# EAGLE design JW24A10L_revB (EAGLE 6.1)
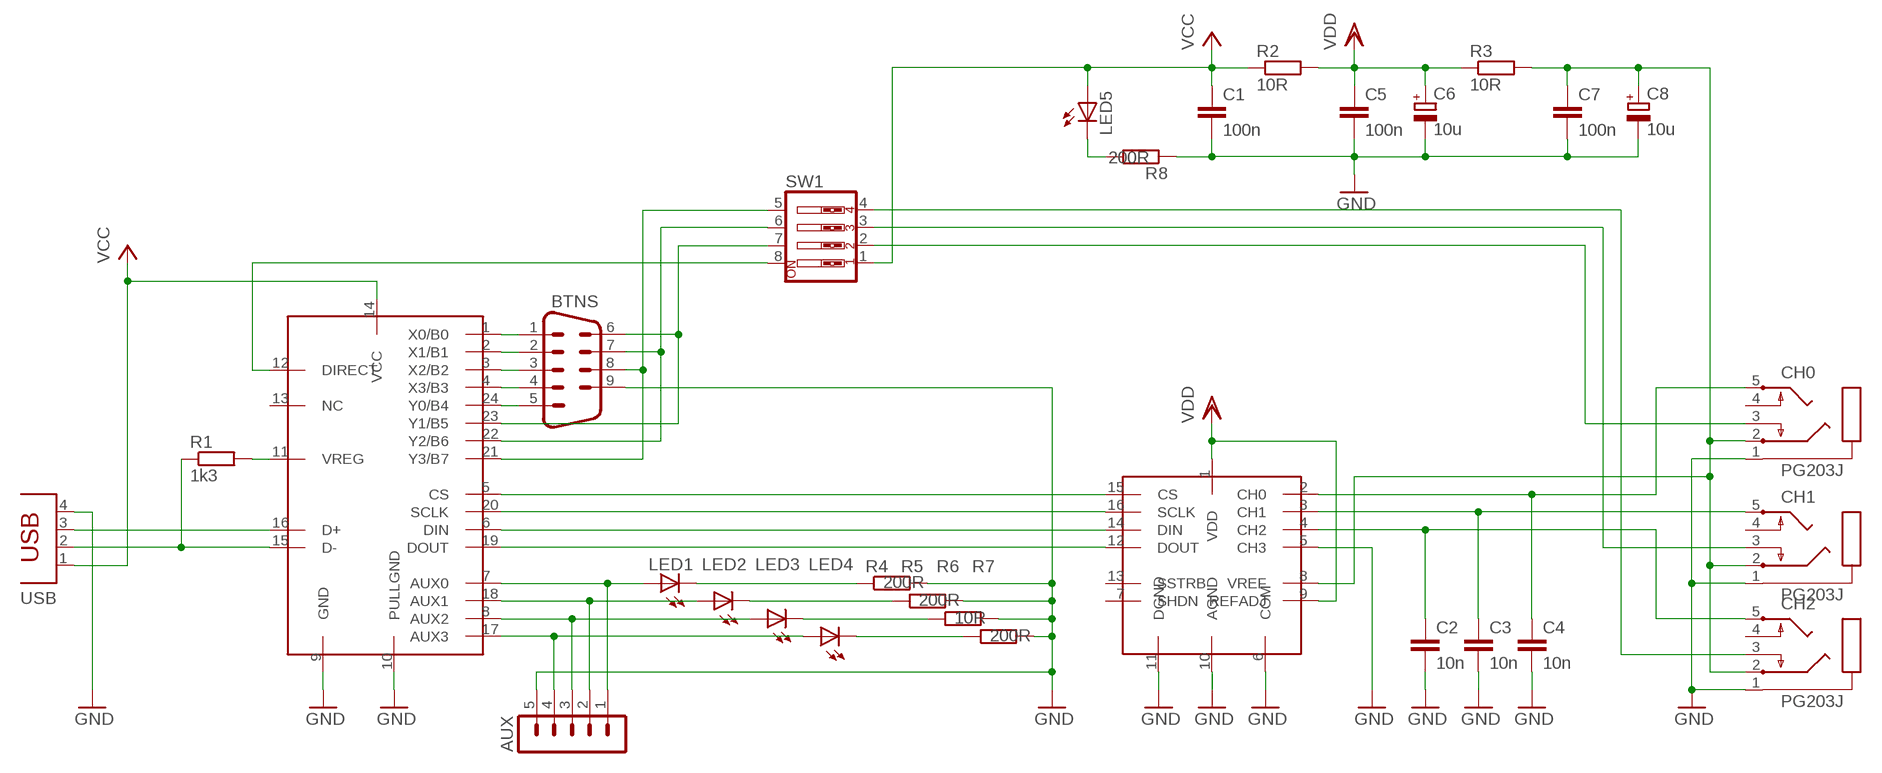
[diagram p0: schematic, sheet 1]

## Parts
AUX  MA05-1  [MA05-1]
BTNS  M09H  [M09H]
C1  100n  C-EU025-025X050  [C025-025X050]
C2  10n  C-EU025-025X050  [C025-025X050]
C3  10n  C-EU025-025X050  [C025-025X050]
C4  10n  C-EU025-025X050  [C025-025X050]
C5  100n  C-EU025-025X050  [C025-025X050]
C6  10u  CPOL-EUE2-5  [E2-5]
C7  100n  C-EU025-025X050  [C025-025X050]
C8  10u  CPOL-EUE2-5  [E2-5]
CH0  PG203J  [PG203J]
CH1  PG203J  [PG203J]
CH2  PG203J  [PG203J]
LED1  LED3MM  [LED3MM]
LED2  LED3MM  [LED3MM]
LED3  LED3MM  [LED3MM]
LED4  LED3MM  [LED3MM]
LED5  LED3MM  [LED3MM]
R1  1k3  R-EU_0204/7  [0204/7]
R2  10R  R-EU_0204/7  [0204/7]
R3  10R  R-EU_0204/7  [0204/7]
R4  200R  R-EU_0204/7  [0204/7]
R5  200R  R-EU_0204/7  [0204/7]
R6  10R  R-EU_0204/7  [0204/7]
R7  200R  R-EU_0204/7  [0204/7]
R8  200R  R-EU_0204/7  [0204/7]
SW1  SW_DIP-4  [EDG-04]
U$1  MAX1249  [DIL16]
U$2  JW24A10L  [DIL24-3]
USB  PN61729  [PN61729]

## Nets
AUX0: AUX.1 LED1.A U$2.7(AUX0)
AUX1: AUX.2 LED2.A U$2.18(AUX1)
AUX2: AUX.3 LED3.A U$2.8(AUX2)
AUX3: AUX.4 LED4.A U$2.17(AUX3)
CH1: C4.1 CH0.5 U$1.2(CH0)
CH2: CH2.3 SW1.4
GND: AUX.5 BTNS.9 C1.2 C2.2 C3.2 C4.2 C5.2 C6.- C7.2 C8.- CH0.1 CH1.1 CH2.1 R4.2 R5.2 R6.2 R7.2 R8.1 U$1.5(CH3) U$1.6(COM) U$1.10(AGND) U$1.11(DGND) U$2.9(GND) U$2.10(PULLGND) USB.4
N$1: U$1.15(CS) U$2.5(CS)
N$2: U$1.16(SCLK) U$2.20(SCLK)
N$3: U$1.14(DIN) U$2.6(DIN)
N$4: U$1.12(DOUT) U$2.19(DOUT)
N$5: U$2.16(D+) USB.3
N$6: R1.1 U$2.15(D-) USB.2
N$7: BTNS.1 U$2.1(X0/B0)
N$8: LED5.K(C) R8.2
N$9: R1.2 U$2.11(VREG)
N$10: C3.1 CH1.5 U$1.3(CH1)
N$11: C2.1 CH2.5 U$1.4(CH2)
N$12: BTNS.2 U$2.2(X1/B1)
N$13: BTNS.3 U$2.3(X2/B2)
N$14: BTNS.4 U$2.4(X3/B3)
N$15: BTNS.5 U$2.24(Y0/B4)
N$16: BTNS.6 SW1.7 U$2.23(Y1/B5)
N$17: BTNS.7 SW1.6 U$2.22(Y2/B6)
N$18: BTNS.8 SW1.5 U$2.21(Y3/B7)
N$19: SW1.8 U$2.12(DIRECT)
N$21: CH1.3 SW1.3
N$22: CH0.3 SW1.2
N$24: C7.1 C8.+ CH0.2 CH1.2 CH2.2 R3.2 U$1.8(VREF)
N$25: LED1.K(C) R4.1
N$26: LED2.K(C) R5.1
N$27: LED3.K(C) R6.1
N$28: LED4.K(C) R7.1
VCC: C1.1 LED5.A R2.1 SW1.1 U$2.14(VCC) USB.1
VDD: C5.1 C6.+ R2.2 R3.1 U$1.1(VDD) U$1.9(REFADJ)
Unconnected: CH0.4 CH1.4 CH2.4 U$1.7(SHDN) U$1.13(SSTRB) U$2.13(NC)

## Library data of the parts
AUX = con-lstb:MA05-1: PIN HEADER; OC_FARNELL: unknown; OC_NEWARK: unknown
BTNS = con-subd:M09: SUB-D; OC_FARNELL: unknown; OC_NEWARK: unknown
C1-C5 C7 = rcl:C-EU: CAPACITOR, European symbol
C6 C8 = rcl:CPOL-EU: POLARIZED CAPACITOR, European symbol
CH0 CH1 CH2 = con-hirschmann:PG203J: MIC/HEADPHONE JACK KS-S stereo microphone/headphone jack PG203JN (Schukat); OC_FARNELL: unknown; OC_NEWARK: unknown
LED1-LED5 = led:LED: LED OSRAM: - CHIPLED LG R971, LG N971, LY N971, LG Q971, LY Q971, LO R971, LY R971 LH N974, LH R974 LS Q976, LO Q976, LY Q976 LO Q996 - Hyper CHIPLED LW Q18S LB Q993, LB Q99A, LB R99A - SideLED LS A670, LO A670, LY A670, LG A670, LP A670 LB A673, LV A673, LT A673, LW A673 LH A674 LY A675 LS A676, LA A676, LO A676, LY A676, LW A676 LS A679, LY A679, LG A679 - Hyper Micro SIDELED® LS Y876, LA Y876, LO Y876, LY Y876 LT Y87S - SmartLED LW L88C, LW L88S LB L89C, LB L89S, LG L890 LS L89K, LO L89K, LY L89K LS L896, LA L896, LO L896, LY L896 - TOPLED LS T670, LO T670, LY T670, LG T670, LP T670 LSG T670, LSP T670, LSY T670, LOP T670, LYG T670 LG T671, LOG T671, LSG T671 LB T673, LV T673, LT T673, LW T673 LH T674 LS T676, LA T676, LO T676, LY T676, LB T676, LH T676, LSB T676, LW T676 LB T67C, LV T67C, LT T67C, LS T67K, LO T67K, LY T67K, LW E67C LS E67B, LA E67B, LO E67B, LY E67B, LB E67C, LV E67C, LT E67C LW T67C LS T679, LY T679, LG T679 LS T770, LO T770, LY T770, LG T770, LP T770 LB T773, LV T773, LT T773, LW T773 LH T774 LS E675, LA E675, LY E675, LS T675 LS T776, LA T776, LO T776, LY T776, LB T776 LHGB T686 LT T68C, LB T68C - Hyper Mini TOPLED® LB M676 - Mini TOPLED Santana® LG M470 LS M47K, LO M47K, LY M47K Source: http://www.osram.convergy.de LUXEON: - LUMILED® LXK2-PW12-R00, LXK2-PW12-S00, LXK2-PW14-U00, LXK2-PW14-V00 LXK2-PM12-R00, LXK2-PM12-S00, LXK2-PM14-U00 LXK2-PE12-Q00, LXK2-PE12-R00, LXK2-PE12-S00, LXK2-PE14-T00, LXK2-PE14-U00 LXK2-PB12-K00, LXK2-PB12-L00, LXK2-PB12-M00, LXK2-PB14-N00, LXK2-PB14-P00, LXK2-PB14-Q00 LXK2-PR12-L00, LXK2-PR12-M00, LXK2-PR14-Q00, LXK2-PR14-R00 LXK2-PD12-Q00, LXK2-PD12-R00, LXK2-PD12-S00 LXK2-PH12-R00, LXK2-PH12-S00 LXK2-PL12-P00, LXK2-PL12-Q00, LXK2-PL12-R00 Source: www.luxeon.com KINGBRIGHT: KA-3528ASYC Source: www.kingbright.com
R1-R8 = rcl:R-EU_: RESISTOR, European symbol
SW1 = special:SW_DIP-4: DIP SWITCH
U$1 = eigene:MAX1249
U$2 = eigene:JW24A10L
USB = con-berg:PN61729: BERG USB connector; OC_FARNELL: unknown; OC_NEWARK: unknown

## Board
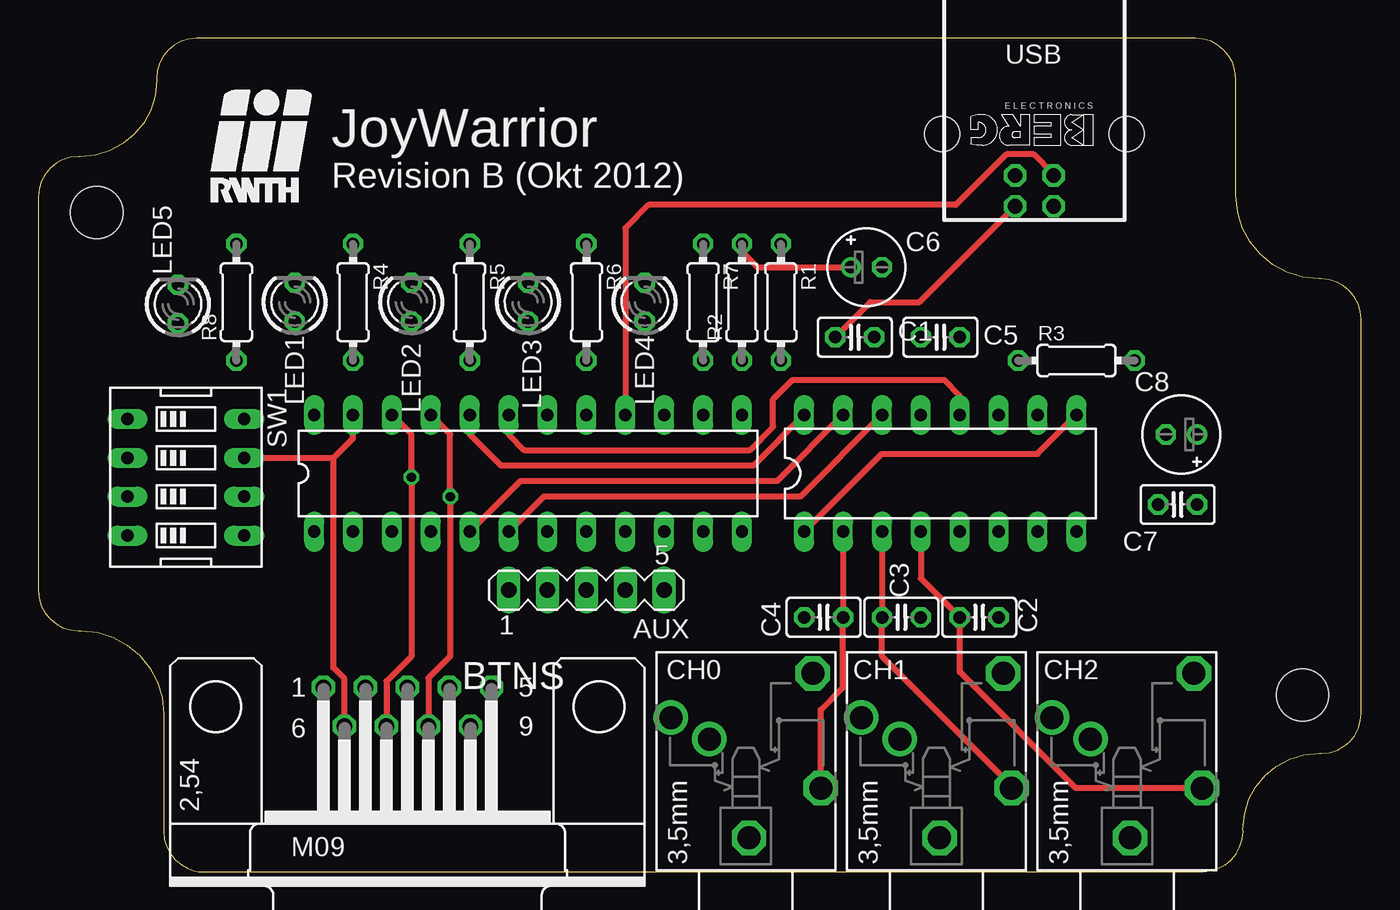
[diagram p1: board, top side]
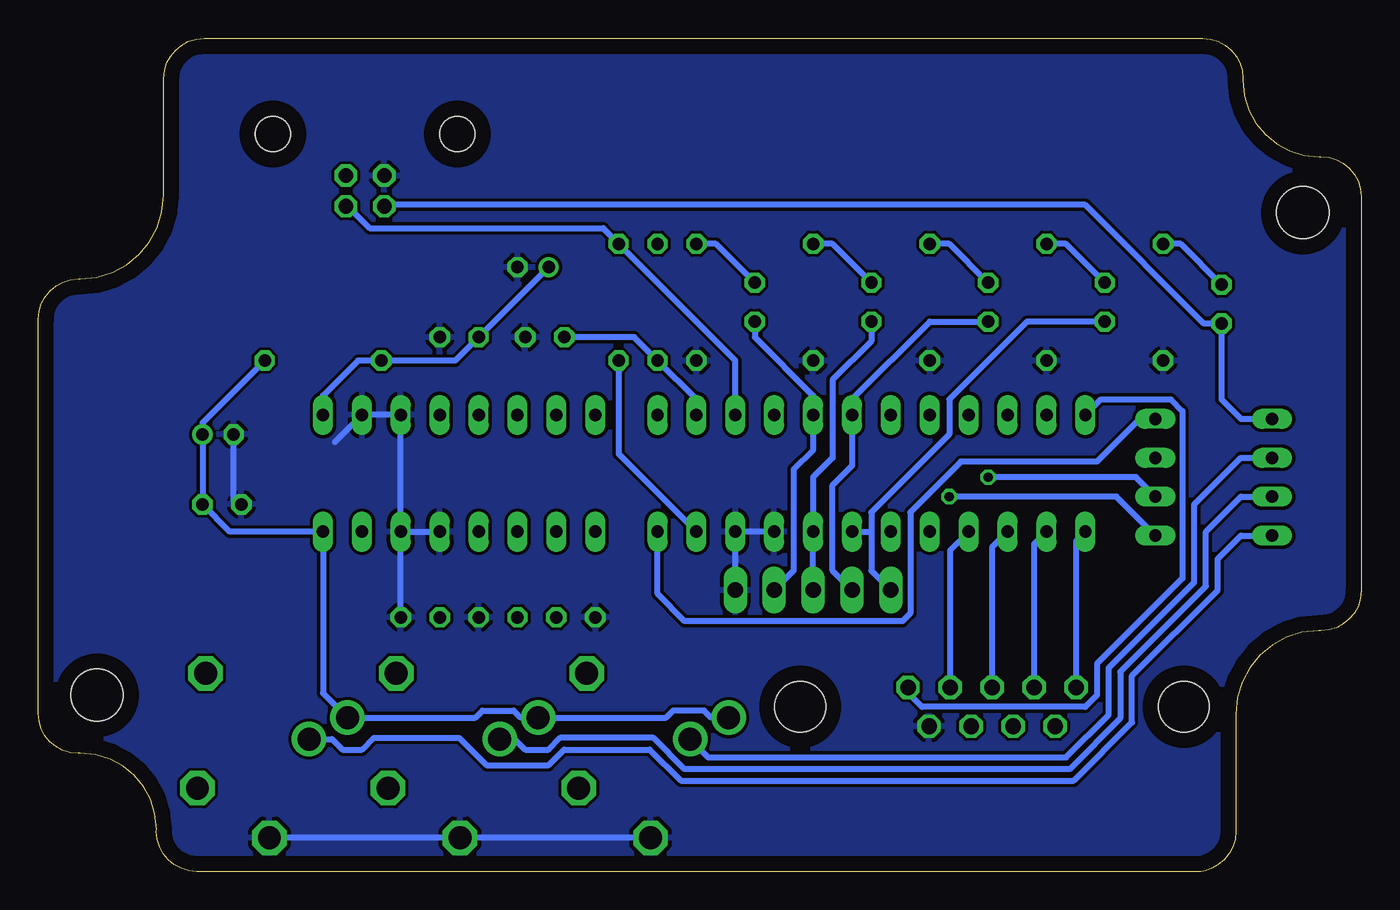
[diagram p2: board, bottom side, seen from below]

Size 86.4 x 54.4 mm. Coordinates in mm from the lower left corner, seen from the top.
Outline: 78.21,51.77 78.16,52.3 78,52.79 77.76,53.24 77.44,53.63 77.05,53.95 76.6,54.19 76.1,54.35 75.57,54.4 10.35,54.4 9.82,54.35 9.33,54.19 8.88,53.95 8.49,53.63 8.17,53.24 7.93,52.79 7.77,52.3 7.72,51.77 7.72,51.65 7.62,50.65 7.33,49.71 6.87,48.86 6.26,48.13 5.52,47.52 4.68,47.07 3.74,46.78 2.74,46.68 2.63,46.68 2.1,46.63 1.61,46.47 1.16,46.23 0.77,45.91 0.45,45.52 0.21,45.07 0.05,44.58 0,44.04 0,18.35 0.05,17.82 0.21,17.32 0.45,16.88 0.77,16.49 1.16,16.17 1.61,15.92 2.1,15.77 2.63,15.72 2.76,15.72 3.87,15.61 4.9,15.29 5.82,14.79 6.62,14.12 7.28,13.31 7.77,12.39 8.08,11.36 8.19,10.26 8.19,2.64 8.24,2.12 8.39,1.63 8.63,1.18 8.96,0.78 9.35,0.45 9.77,0.2 10.16,0.05 10.47,0 76.05,0 76.58,0.06 77.08,0.21 77.53,0.45 77.92,0.78 78.24,1.17 78.48,1.61 78.63,2.11 78.69,2.64 78.68,2.76 78.78,3.77 79.07,4.71 79.52,5.55 80.13,6.28 80.86,6.88 81.71,7.33 82.64,7.62 83.66,7.71 83.79,7.72 84.33,7.77 84.82,7.92 85.27,8.17 85.65,8.49 85.96,8.88 86.2,9.32 86.35,9.82 86.4,10.35 86.4,36.04 86.35,36.57 86.19,37.07 85.95,37.52 85.63,37.91 85.24,38.23 84.79,38.48 84.3,38.63 83.77,38.69 83.67,38.69 82.57,38.8 81.55,39.11 80.62,39.62 79.81,40.28 79.15,41.09 78.65,42.02 78.33,43.04 78.22,44.14 78.21,51.77
Copper layers (1*16): Top 0.035mm / dielectric 1.5mm / Bottom 0.035mm
Design rules: minimum track width 10mil, minimum drill 24mil, track to track 8mil, track to pad 8mil, pad to pad 8mil, via to via 8mil, smd to smd 8mil, copper to edge 40mil, drill to drill 8mil, minimum pad ring 10mil, minimum via ring 8mil, stop-mask expansion 4mil, vias tented up to drill 0mil, thermal gap 10mil
Holes 3.4 mm at 3.82,43.01 82.56,11.52

### Footprints (pad centres in the part's own frame; a part is rotated, then mirrored left to right if it is on the bottom)
MA05-1 = drill 1.016 long: 1 -5.08,0; 2 -2.54,0; 3 0,0; 4 2.54,0; 5 5.08,0
M09H = drill 1.016 octagon: 1 -5.486,1.27; 2 -2.743,1.27; 3 0,1.27; 4 2.743,1.27; 5 5.486,1.27; 6 -4.115,-1.27; 7 -1.372,-1.27; 8 1.372,-1.27; 9 4.115,-1.27 | hole 3.302: 12.522,0; -12.522,0
C025-025X050 = drill 0.813 octagon: 1 -1.27,0; 2 1.27,0
E2-5 = drill 0.813 pad 1.27: + -1.016,0 | drill 0.813 pad 1.27 octagon: - 1.016,0
PG203J = drill 1.499 octagon: 1 -5.004,-0.203; 4 5.74,-4.369; 5 -1.753,-4.902 | drill 1.499: 2 2.845,4.902; 3 1.448,2.388
LED3MM = drill 0.813 octagon: A -1.27,0; K 1.27,0
0204/7 = drill 0.813 octagon: 1 -3.81,0; 2 3.81,0
EDG-04 = drill 0.813 long: 1 -3.81,-3.81; 2 -1.27,-3.81; 3 1.27,-3.81; 4 3.81,-3.81; 5 3.81,3.81; 6 1.27,3.81; 7 -1.27,3.81; 8 -3.81,3.81
DIL16 = drill 0.813 long: 1 -8.89,-3.81; 2 -6.35,-3.81; 3 -3.81,-3.81; 4 -1.27,-3.81; 5 1.27,-3.81; 6 3.81,-3.81; 7 6.35,-3.81; 8 8.89,-3.81; 9 8.89,3.81; 10 6.35,3.81; 11 3.81,3.81; 12 1.27,3.81; 13 -1.27,3.81; 14 -3.81,3.81; 15 -6.35,3.81; 16 -8.89,3.81
DIL24-3 = drill 0.813 long: 1 -13.97,-3.81; 2 -11.43,-3.81; 3 -8.89,-3.81; 4 -6.35,-3.81; 5 -3.81,-3.81; 6 -1.27,-3.81; 7 1.27,-3.81; 8 3.81,-3.81; 9 6.35,-3.81; 10 8.89,-3.81; 11 11.43,-3.81; 12 13.97,-3.81; 13 13.97,3.81; 14 11.43,3.81; 15 8.89,3.81; 16 6.35,3.81; 17 3.81,3.81; 18 1.27,3.81; 19 -1.27,3.81; 20 -3.81,3.81; 21 -6.35,3.81; 22 -8.89,3.81; 23 -11.43,3.81; 24 -13.97,3.81
PN61729 = drill 0.95 octagon: 1 1.25,4.71; 2 -1.25,4.71; 3 -1.25,2.71; 4 1.25,2.71 | hole 2.3: -6.02,0; 6.02,0

### Placement (x,y rotation side)
AUX  35.8,18.38 0 top
BTNS  24.11,10.76 0 top
C1  53.32,34.89 0 top
C2  61.45,16.6 0 top
C3  56.37,16.6 0 top
C4  51.29,16.6 180 top
C5  58.91,34.89 0 top
C6  54.09,39.46 0 top
C7  74.41,23.96 180 top
C8  74.66,28.54 180 top
CH0  46.21,7.2 90 top
CH1  58.66,7.2 90 top
CH2  71.1,7.2 90 top
LED1  16.75,37.17 90 top
LED2  24.37,37.17 90 top
LED3  31.99,37.17 90 top
LED4  39.61,37.17 90 top
LED5  9.13,37.04 90 top
R1  48.5,37.17 270 top
R2  45.96,37.17 90 top
R3  67.8,33.36 0 top
R4  20.56,37.17 270 top
R5  28.18,37.17 270 top
R6  35.8,37.17 270 top
R7  43.42,37.17 270 top
R8  12.94,37.17 90 top
SW1  9.64,25.74 270 top
U$1  58.91,26 0 top
U$2  31.99,26 0 top
USB  65.06,48.14 180 top

### Tracks (layer width: path | path; a pad name or v marks a point on that pad's centre or on a via)
AUX0
  Bottom 0.406: 31.99,22.19 31.99,23.46 26.91,28.54 26.91,30.82 21.83,35.9 LED1.A | 31.99,22.19 31.99,19.65 AUX.1 | U$2.7 31.99,22.19
AUX1
  Bottom 0.406: AUX.2 34.53,19.65 34.53,25.23 33.26,26.5 U$2.18 33.26,30.82 28.18,35.9 LED2.A
AUX2
  Bottom 0.406: LED3.A 31.99,34.63 34.53,32.09 34.53,27.01 35.8,25.74 U$2.8 AUX.3
AUX3
  Bottom 0.406: AUX.4 37.07,19.65 37.07,26.25 35.8,27.52 U$2.17 35.8,31.08 39.61,34.89 LED4.A
CH1
  Top 0.406: U$1.2 C4.1 52.56,12.03 51.11,10.58 CH0.5
CH2
  Bottom 0.406: CH2.3 67.22,8.65 66.53,7.96 65.26,7.96 64.5,8.72 58.91,8.72 57.13,6.95 53.07,6.95 52.05,7.96 46.47,7.96 44.43,5.93 18.78,5.93 14.97,9.74 14.97,12.79 9.38,18.38 9.38,20.41 7.86,21.93 SW1.4
GND
  Bottom 0.406: C7.2 73.39,23.96 73.64,24.22 C8.- | U$1.6 U$1.11 U$1.10 67.04,28.03 | U$1.6 U$1.5 | CH0.1 CH1.1 CH2.1 | U$2.9 U$2.10 AUX.5 | C2.2 U$1.6
  pour Bottom: 78.21,51.87 78.16,52.4 78,52.89 77.76,53.34 77.44,53.73 77.05,54.05 76.6,54.29 76.1,54.45 75.57,54.5 10.35,54.5 9.33,54.28 8.49,53.64 7.93,52.59 7.72,51.15 7.62,50.35 7.34,49.56 6.9,48.82 6.34,48.16 5.67,47.59 4.93,47.16 4.14,46.88 3.33,46.78 1.9,46.58 0.86,46.01 0.22,45.17 0,44.15 0,18.45 0.22,17.43 0.88,16.59 1.97,16.03 3.49,15.82 4.36,15.71 5.21,15.39 6,14.89 6.71,14.22 7.32,13.42 7.78,12.49 8.08,11.46 8.19,10.36 8.19,2.74 8.22,2.26 8.34,1.79 8.52,1.34 8.77,0.93 9.1,0.59 9.49,0.32 9.95,0.16 10.47,0.1 76.05,0.1 77.08,0.32 77.92,0.97 78.48,2.02 78.68,3.46 78.78,4.28 79.06,5.06 79.49,5.8 80.06,6.46 80.72,7.01 81.46,7.44 82.26,7.72 83.08,7.82 84.52,8.02 85.56,8.59 86.19,9.42 86.4,10.45 86.4,36.14 86.18,37.17 85.53,38.01 84.45,38.58 82.94,38.79 82.08,38.9 81.24,39.22 80.44,39.72 79.72,40.39 79.11,41.19 78.63,42.12 78.33,43.15 78.22,44.25
N$1
  Top 0.406: U$1.15 48.24,25.49 31.48,25.49 U$2.5
N$2
  Top 0.406: U$1.16 46.72,26.5 30.21,26.5 28.18,28.54 U$2.20
N$3
  Top 0.406: U$1.14 49.77,24.47 33,24.47 U$2.6
N$4
  Top 0.406: U$2.19 30.72,28.54 31.73,27.52 46.47,27.52 47.99,29.04 47.99,30.82 49.26,32.09 59.17,32.09 60.18,31.08 U$1.12
N$5
  Top 0.406: USB.3 66.31,45.52 65.01,46.82 63.23,46.82 59.93,43.52 39.86,43.52 38.34,42 U$2.16
N$6
  Bottom 0.406: USB.2 66.19,43.43 64.75,42 49.51,42 R1.1 40.88,33.36 U$2.15
N$7
  Bottom 0.406: U$2.1 18.63,21.58 BTNS.1
N$8
  Bottom 0.406: LED5.K 11.79,40.98 R8.2
N$9
  Bottom 0.406: R1.2 48.5,27.27 U$2.11
N$10
  Top 0.406: U$1.3 C3.1 55.1,14.06 63.56,5.6 CH1.5
N$11
  Top 0.406: U$1.4 57.64,21.68 57.64,19.14 C2.1 60.18,13.04 67.78,5.45 CH2.5
N$12
  Bottom 0.406: U$2.2 21.37,21.37 BTNS.2
N$13
  Bottom 0.406: U$2.3 24.11,21.17 BTNS.3
N$14
  Bottom 0.406: U$2.4 26.86,20.97 BTNS.4
N$15
  Bottom 0.406: U$2.24 17,30.82 12.43,30.82 11.67,30.06 11.67,19.14 17.26,13.55 17.26,11.52 18.02,10.76 28.69,10.76 29.6,11.67 BTNS.5
N$16
  Top 0.406: BTNS.6 20,12.58 19.29,13.3 19.29,27.01 | SW1.7 19.29,27.01 | 19.29,27.01 20.56,28.28 U$2.23
N$17  (via drill 0.6)
  Top 0.406: BTNS.7 22.74,12.43 24.37,14.06 v24.37,25.74 24.37,28.54 U$2.22
  Bottom 0.406: SW1.6 14.72,25.74 v24.37,25.74
N$18  (via drill 0.6)
  Top 0.406: BTNS.8 25.49,12.64 26.91,14.06 v26.91,24.47 26.91,28.54 U$2.21
  Bottom 0.406: SW1.5 15.99,24.47 v26.91,24.47
N$19
  Bottom 0.406: U$2.12 45.96,18.12 44.18,16.34 29.96,16.34 29.45,16.85 29.45,23.46 26.15,26.76 17.26,26.76 14.46,29.55 SW1.8
N$21
  Bottom 0.406: CH1.3 55.28,8.65 54.59,7.96 53.07,7.96 52.31,8.72 46.21,8.72 44.18,6.69 19.03,6.69 15.73,9.99 15.73,13.04 10.14,18.63 10.14,22.19 7.86,24.47 SW1.3
N$22
  Bottom 0.406: CH0.3 43.85,8.65 42.66,7.45 19.29,7.45 16.49,10.25 16.49,13.3 10.91,18.88 10.91,23.96 7.86,27.01 SW1.2
N$24
  Bottom 0.406: CH0.2 42.45,10.04 42.91,10.5 44.94,10.5 45.4,10.04 CH1.2 54.9,10.04 55.36,10.5 57.39,10.5 57.84,10.04 CH2.2 67.8,11.64 U$1.8 73.9,22.19 C7.1 C8.+ 75.68,29.3 R3.2
N$25
  Bottom 0.406: LED1.K 19.29,40.98 R4.1
N$26
  Bottom 0.406: LED2.K 26.91,40.98 R5.1
N$27
  Bottom 0.406: LED3.K 34.53,40.98 R6.1
N$28
  Bottom 0.406: LED4.K 42.15,40.98 R7.1
VCC
  Top 0.406: C1.1 54.34,37.17 57.55,37.17 USB.1
  Bottom 0.406: USB.1 63.72,43.52 18.02,43.52 10.27,35.77 LED5.A 9.13,30.82 7.86,29.55 SW1.1 | U$2.14 43.42,30.82 R2.1 47.48,34.89 C1.1
VDD
  Top 0.406: U$1.1 55.1,27.27 56.37,27.27 65.26,27.27 U$1.9 | R2.2 45.96,40.47 46.97,39.46 C6.+
  Bottom 0.406: C6.+ C5.1 59.17,33.36 R3.1 65.01,33.36 65.52,33.36 67.8,31.08 U$1.9

### Text on the board
tPlace: JoyWarrior | Revision B (Okt 2012)